# Altium project AudioDSP-v2.0.PrjPcb
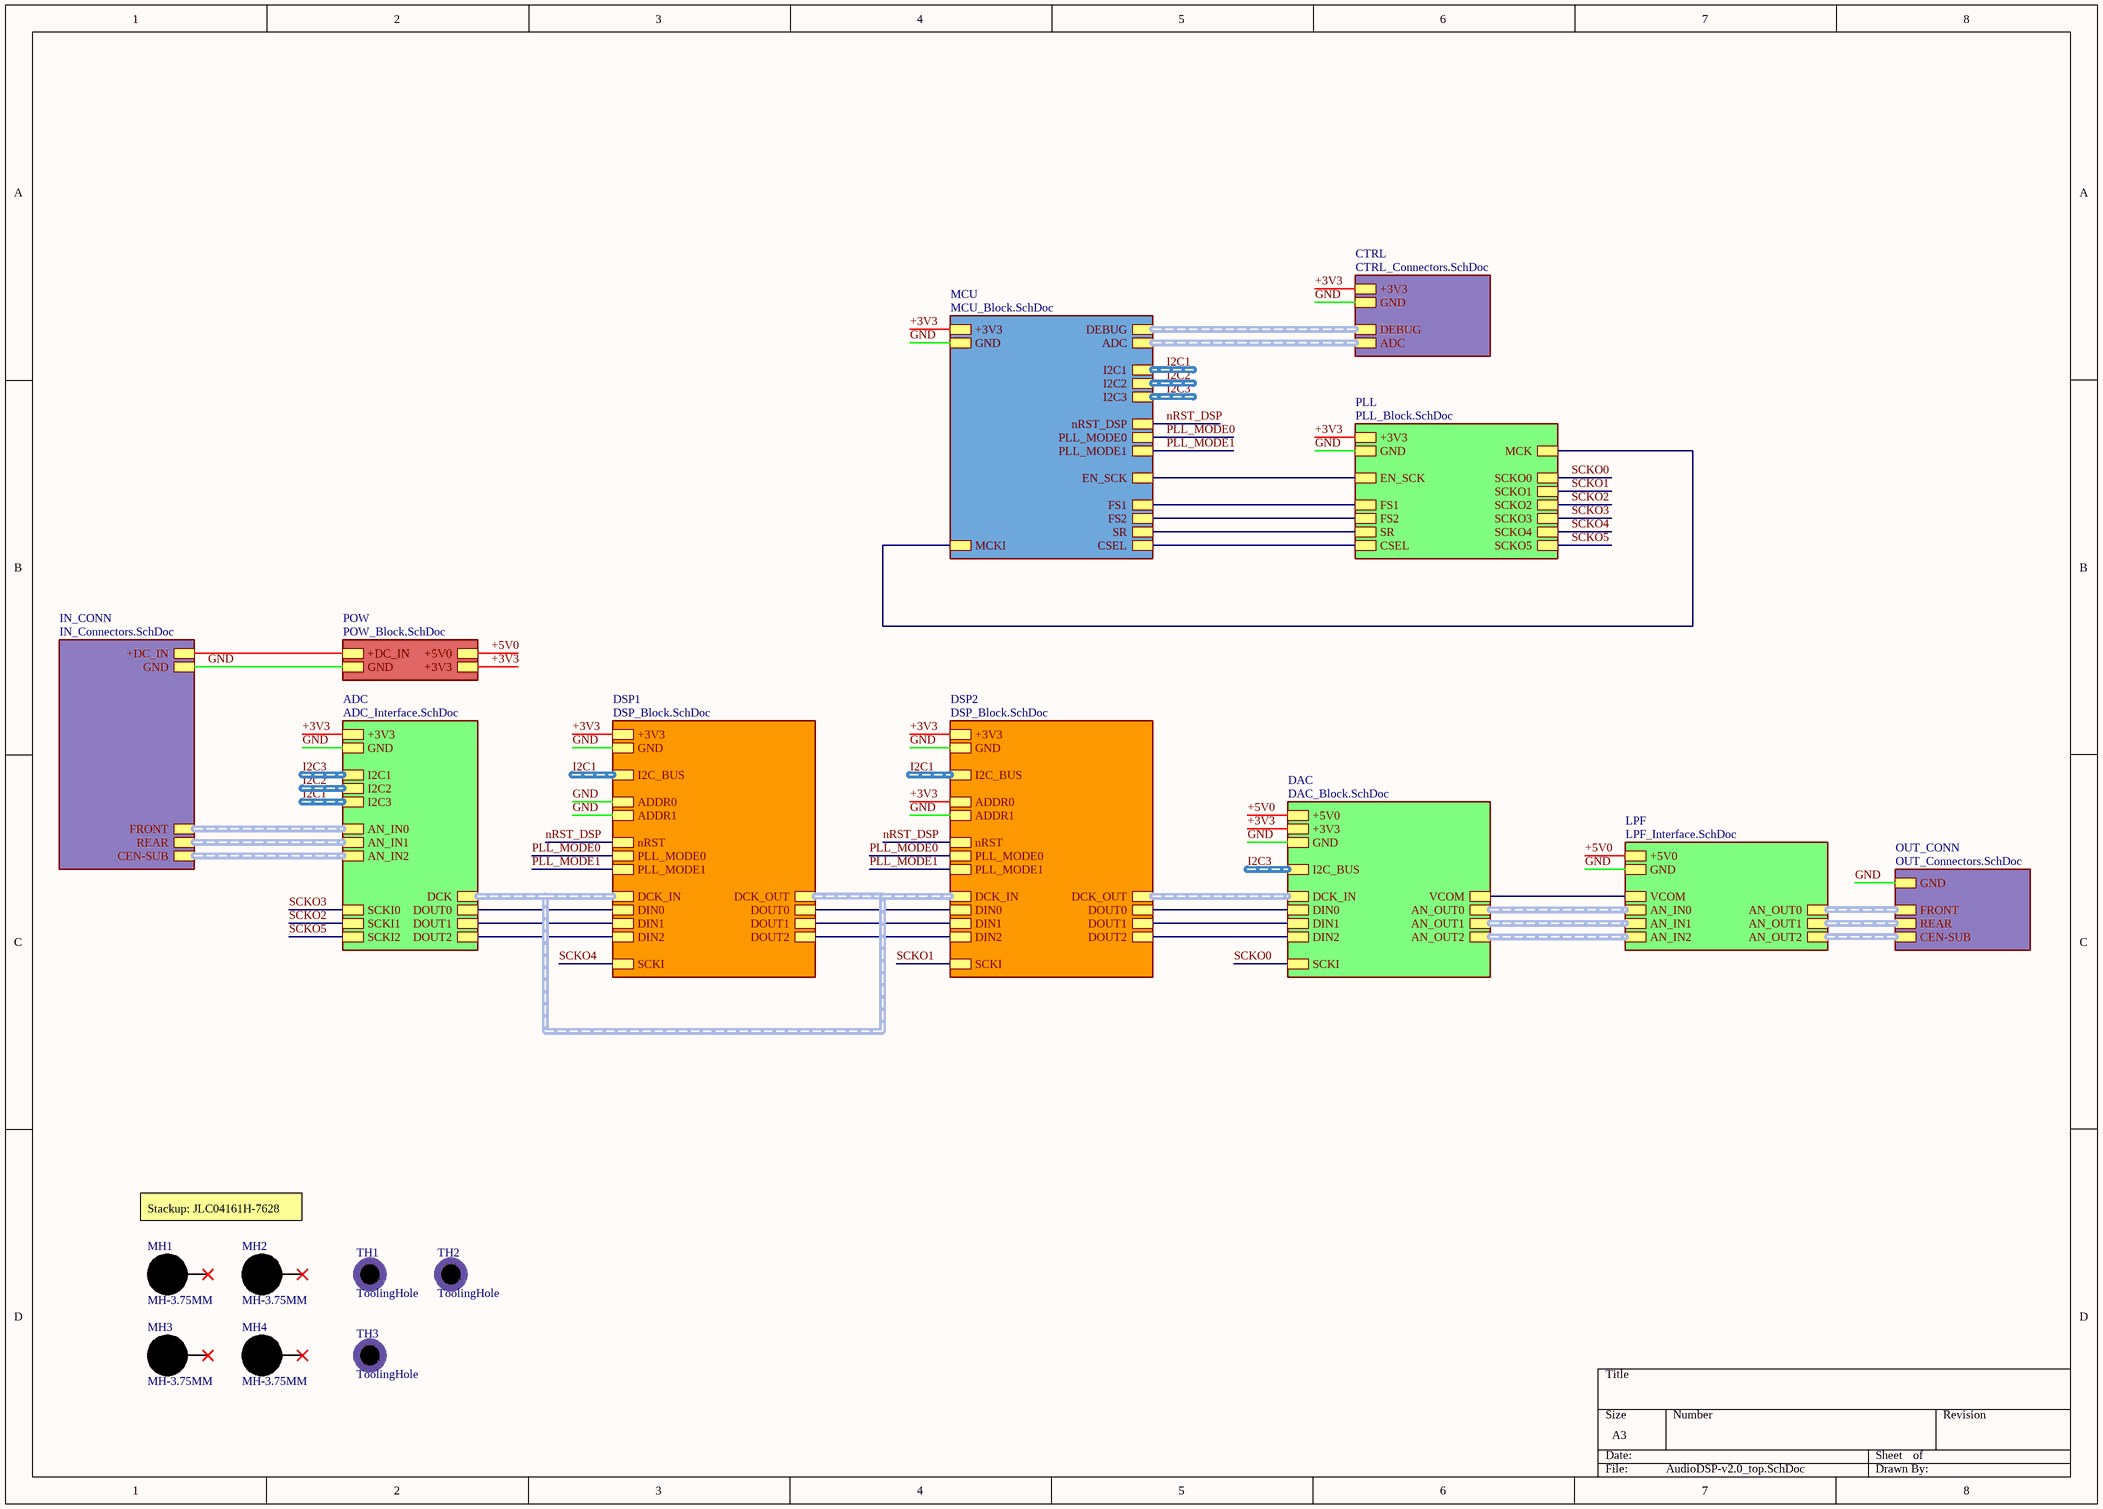
[diagram p0: AudioDSP-v2.0_top.SchDoc]
9 sheets, 164 parts. Net scope: hierarchical (ports join the sheet entries above them; power ports are global).
Board file: AudioDSP-2.0.PcbDoc
Sheets:
  AudioDSP-v2.0_top.SchDoc
    PLL = PLL_Block.SchDoc
    DSP1 = DSP_Block.SchDoc
    DSP2 = DSP_Block.SchDoc
    DAC = DAC_Block.SchDoc
    POW = POW_Block.SchDoc
    MCU = MCU_Block.SchDoc
    CTRL = CTRL_Connectors.SchDoc
  ADC_Block.SchDoc
  LPF_Block.SchDoc

## Sheet AudioDSP-v2.0_top.SchDoc
size A3; SheetNumber: 1; SheetTotal: 13

### Parts
MH1  MH-3.75MM  [MH-3.75mm-NP]  (no BOM)
MH2  MH-3.75MM  [MH-3.75mm-NP]  (no BOM)
MH3  MH-3.75MM  [MH-3.75mm-NP]  (no BOM)
MH4  MH-3.75MM  [MH-3.75mm-NP]  (no BOM)
TH1  ToolingHole  [TOOLING-HOLE]  (no BOM)
TH2  ToolingHole  [TOOLING-HOLE]  (no BOM)
TH3  ToolingHole  [TOOLING-HOLE]  (no BOM)

### Sub-sheets
ADC = ADC_Interface.SchDoc (file not in this document): +3V3, GND, I2C1 (harness I2C), AN_IN1 (harness AN), SCKI0, I2C2 (harness I2C), I2C3 (harness I2C), SCKI2, SCKI1, AN_IN2 (harness AN), AN_IN0 (harness AN), DCK (harness DCK), DOUT0, DOUT1, DOUT2
CTRL = CTRL_Connectors.SchDoc: DEBUG (harness SW), +3V3, GND, ADC (harness ADC)
DAC = DAC_Block.SchDoc: +3V3, GND, I2C_BUS (harness I2C), +5V0, VCOM, DIN0, DIN1, DIN2, DCK_IN (harness DCK), SCKI, AN_OUT0 (harness AN), AN_OUT1 (harness AN), AN_OUT2 (harness AN)
DSP1 = DSP_Block.SchDoc: +3V3, GND, PLL_MODE0, PLL_MODE1, SCKI, nRST, ADDR0, ADDR1, I2C_BUS (harness I2C), DCK_IN (harness DCK), DIN0, DIN1, DIN2, DCK_OUT (harness DCK), DOUT0, DOUT1, DOUT2
DSP2 = DSP_Block.SchDoc: +3V3, GND, PLL_MODE0, PLL_MODE1, SCKI, nRST, ADDR0, ADDR1, I2C_BUS (harness I2C), DCK_IN (harness DCK), DIN0, DIN1, DIN2, DCK_OUT (harness DCK), DOUT0, DOUT1, DOUT2
IN_CONN = IN_Connectors.SchDoc (file not in this document): +DC_IN, GND, FRONT (harness AN), REAR (harness AN), CEN-SUB (harness AN)
LPF = LPF_Interface.SchDoc (file not in this document): +5V0, GND, VCOM, AN_IN0 (harness AN), AN_IN1 (harness AN), AN_IN2 (harness AN), AN_OUT0 (harness AN), AN_OUT1 (harness AN), AN_OUT2 (harness AN)
MCU = MCU_Block.SchDoc: +3V3, GND, DEBUG (harness SW), ADC (harness ADC), I2C1 (harness I2C), I2C2 (harness I2C), I2C3 (harness I2C), MCKI, nRST_DSP, PLL_MODE0, PLL_MODE1, EN_SCK, FS1, FS2, SR, CSEL
OUT_CONN = OUT_Connectors.SchDoc (file not in this document): FRONT (harness AN), REAR (harness AN), CEN-SUB (harness AN), GND
PLL = PLL_Block.SchDoc: +3V3, GND, FS1, FS2, SR, CSEL, MCK, EN_SCK, SCKO0, SCKO1, SCKO2, SCKO3, SCKO4, SCKO5
POW = POW_Block.SchDoc: +DC_IN, GND, +5V0, +3V3

### Nets
+3V3: sheet PLL/+3V3, sheet DSP1/+3V3, sheet DSP2/+3V3, sheet DSP2/ADDR0, sheet DAC/+3V3, sheet POW/+3V3, sheet MCU/+3V3, sheet CTRL/+3V3, sheet ADC/+3V3
+5V0: sheet DAC/+5V0, sheet POW/+5V0, sheet LPF/+5V0
+DC_IN: sheet POW/+DC_IN, sheet IN_CONN/+DC_IN
CSEL: sheet PLL/CSEL, sheet MCU/CSEL
EN_SCK: sheet PLL/EN_SCK, sheet MCU/EN_SCK
FS1: sheet PLL/FS1, sheet MCU/FS1
FS2: sheet PLL/FS2, sheet MCU/FS2
GND: sheet PLL/GND, sheet DSP1/GND, sheet DSP1/ADDR0, sheet DSP1/ADDR1, sheet DSP2/GND, sheet DSP2/ADDR1, sheet DAC/GND, sheet POW/GND, sheet IN_CONN/GND, sheet OUT_CONN/GND, sheet MCU/GND, sheet CTRL/GND, sheet ADC/GND, sheet LPF/GND
MCK: sheet PLL/MCK, sheet MCU/MCKI
nRST_DSP: sheet DSP1/nRST, sheet DSP2/nRST, sheet MCU/nRST_DSP
PLL_MODE0: sheet DSP1/PLL_MODE0, sheet DSP2/PLL_MODE0, sheet MCU/PLL_MODE0
PLL_MODE1: sheet DSP1/PLL_MODE1, sheet DSP2/PLL_MODE1, sheet MCU/PLL_MODE1
SCKO0: sheet PLL/SCKO0, sheet DAC/SCKI
SCKO1: sheet PLL/SCKO1, sheet DSP2/SCKI
SCKO2: sheet PLL/SCKO2, sheet ADC/SCKI1
SCKO3: sheet PLL/SCKO3, sheet ADC/SCKI0
SCKO4: sheet PLL/SCKO4, sheet DSP1/SCKI
SCKO5: sheet PLL/SCKO5, sheet ADC/SCKI2
SR: sheet PLL/SR, sheet MCU/SR
NetU1#2_6: sheet DSP2/DOUT0, sheet DAC/DIN0
NetU1#2_11: sheet DSP2/DOUT1, sheet DAC/DIN1
NetU1#2_12: sheet DSP2/DOUT2, sheet DAC/DIN2
NetU1_DSP1_10: sheet DSP1/DIN1, sheet ADC/DOUT1
NetU1_DSP1_11: sheet DSP1/DIN0, sheet ADC/DOUT0
NetU1_DSP1_14: sheet DSP1/DOUT1, sheet DSP2/DIN1
NetU1_DSP1_15: sheet DSP1/DOUT0, sheet DSP2/DIN0
NetU1_DSP1_27: sheet DSP1/DOUT2, sheet DSP2/DIN2
NetU1_DSP1_29: sheet DSP1/DIN2, sheet ADC/DOUT2
NetU2#2_1: sheet DAC/VCOM, sheet LPF/VCOM

Not connected (* = marked no-connect by the designer): MH1 1*; MH2 1*; MH3 1*; MH4 1*

### Buses and harness runs
harness I2C1 = sheet ADC/I2C3
harness I2C1 = sheet DSP1/I2C_BUS
harness I2C1 = sheet DSP2/I2C_BUS
harness I2C1 = sheet MCU/I2C1
harness I2C2 = sheet ADC/I2C2
harness I2C2 = sheet MCU/I2C2
harness I2C3 = sheet ADC/I2C1
harness I2C3 = sheet DAC/I2C_BUS
harness I2C3 = sheet MCU/I2C3
harness sheet ADC/AN_IN0 = sheet IN_CONN/FRONT
harness sheet ADC/AN_IN1 = sheet IN_CONN/REAR
harness sheet ADC/AN_IN2 = sheet IN_CONN/CEN-SUB
harness sheet ADC/DCK = sheet DSP1/DCK_IN = sheet DSP1/DCK_OUT = sheet DSP2/DCK_IN
harness sheet CTRL/ADC = sheet MCU/ADC
harness sheet CTRL/DEBUG = sheet MCU/DEBUG
harness sheet DAC/AN_OUT0 = sheet LPF/AN_IN0
harness sheet DAC/AN_OUT1 = sheet LPF/AN_IN1
harness sheet DAC/AN_OUT2 = sheet LPF/AN_IN2
harness sheet DAC/DCK_IN = sheet DSP2/DCK_OUT
harness sheet LPF/AN_OUT0 = sheet OUT_CONN/FRONT
harness sheet LPF/AN_OUT1 = sheet OUT_CONN/REAR
harness sheet LPF/AN_OUT2 = sheet OUT_CONN/CEN-SUB

### Notes on the sheet
- Stackup: JLC04161H-7628

### Library data of the parts
MH1-MH4 = MH-3.75MM: ClassName: MountHole
TH1-TH3 = ToolingHole: ClassName: Tooling

## Sheet PLL_Block.SchDoc
size A4; SheetNumber: 2; SheetTotal: 13
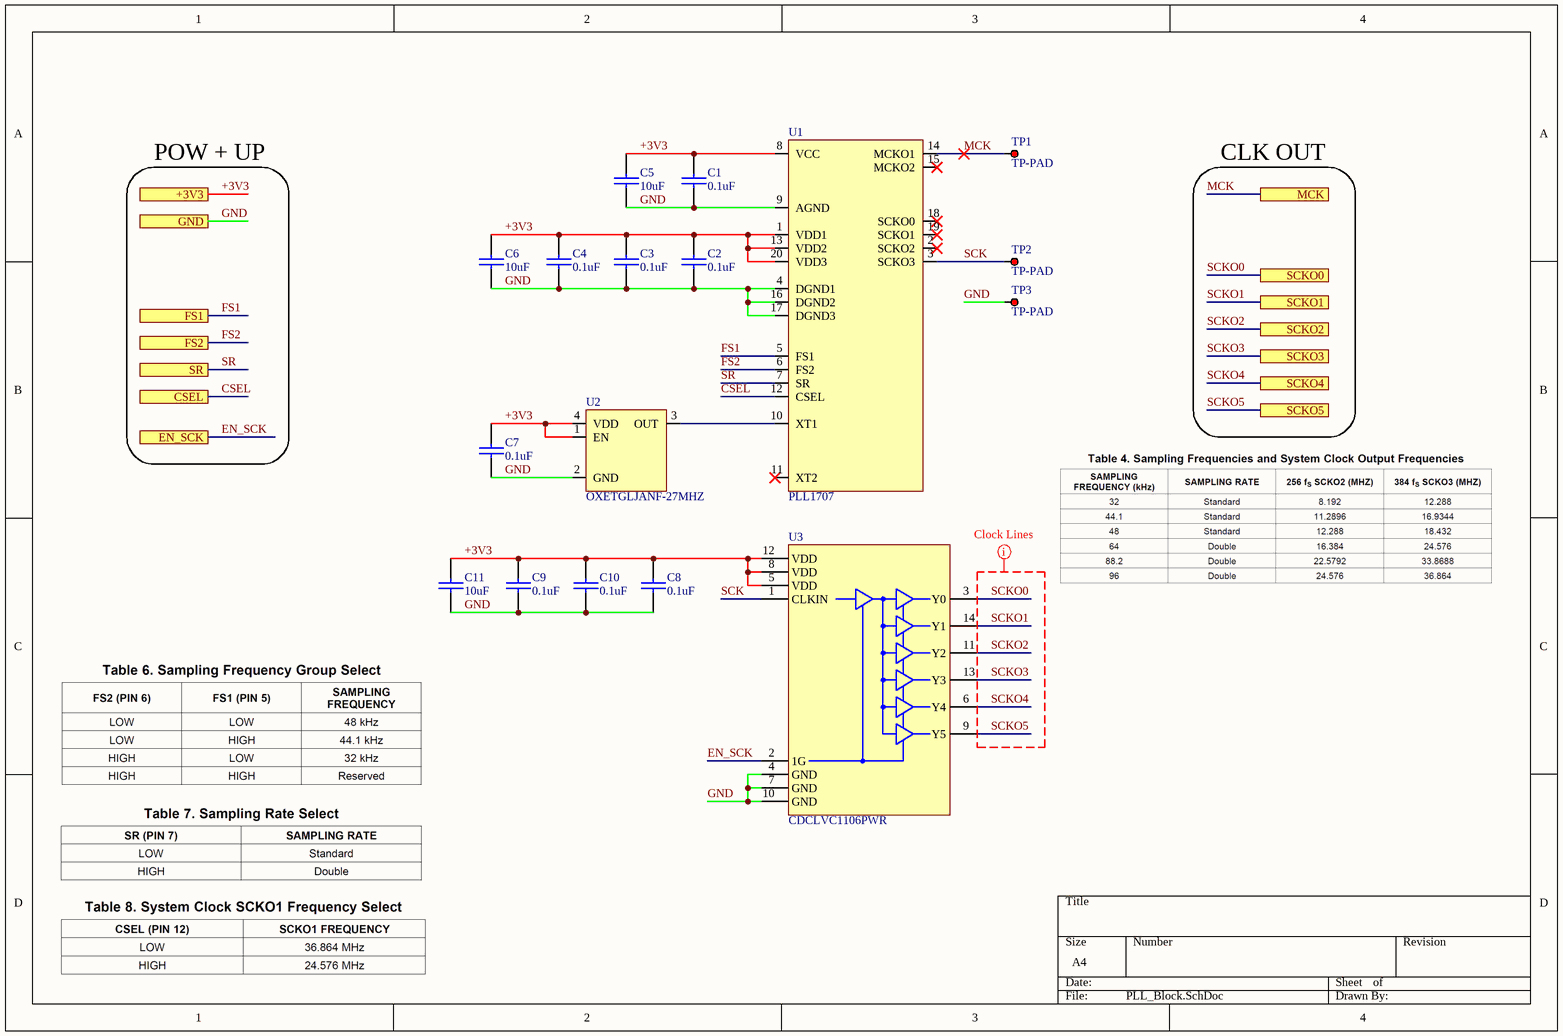
[diagram p1: PLL_Block.SchDoc]

### Parts
(Parts that share a designator on the sheet are numbered #1, #2 ... from top to bottom, then left to right.)
C1#1  0.1uF  [0402-CAP-TDK]
C2#1  0.1uF  [0402-CAP-TDK]
C3#1  0.1uF  [0402-CAP-TDK]
C4#1  0.1uF  [0402-CAP-TDK]
C5#1  10uF  [0603-CAP-TDK]
C6#1  10uF  [0603-CAP-TDK]
C7#1  0.1uF  [0402-CAP-TDK]
C8#1  0.1uF  [0402-CAP-TDK]
C9#1  0.1uF  [0402-CAP-TDK]
C10#1  0.1uF  [0402-CAP-TDK]
C11  10uF  [0603-CAP-TDK]
TP1#1  TP-PAD  [TPTH - PAD TOP]  (no BOM)
TP2#1  TP-PAD  [TPTH - PAD TOP]  (no BOM)
TP3#1  TP-PAD  [TPTH - PAD TOP]  (no BOM)
U1#1  PLL1707  [TI-SSOP-20 - DBQ (R-PDSO-G20)]
U2#1  OXETGLJANF-27MHZ  [SMD3225]
U3  CDCLVC1106PWR  [TI-TSSOP-14-PW0014A]

### Ports
+3V3 (see AudioDSP-v2.0_top[6B], ADC_Block[1A], ADC_Interface[1B], CTRL_Connectors[1A], DAC_Block[1B], DSP_Block[1A], MCU_Block[1A], POW_Block[4B]), CSEL (see AudioDSP-v2.0_top[6B], MCU_Block[4C]), EN_SCK (see AudioDSP-v2.0_top[6B], MCU_Block[4C]), FS1 (see AudioDSP-v2.0_top[6B], MCU_Block[4C]), FS2 (see AudioDSP-v2.0_top[6B], MCU_Block[4C]), GND (see AudioDSP-v2.0_top[6B], ADC_Block[1B], ADC_Interface[1B], CTRL_Connectors[1A], DAC_Block[1B], DSP_Block[1B], IN_Connectors[3A], LPF_Block[1B], LPF_Interface[1B], MCU_Block[1B], OUT_Connectors[3B], POW_Block[1B]), MCK (see AudioDSP-v2.0_top[6B]), SCKO0 (see AudioDSP-v2.0_top[6B]), SCKO1 (see AudioDSP-v2.0_top[6B]), SCKO2 (see AudioDSP-v2.0_top[6B]), SCKO3 (see AudioDSP-v2.0_top[6B]), SCKO4 (see AudioDSP-v2.0_top[6B]), SCKO5 (see AudioDSP-v2.0_top[6B]), SR (see AudioDSP-v2.0_top[6B], MCU_Block[4C])

### Nets
+3V3: C1#1.2 C2#1.2 C3#1.2 C4#1.2 C5#1.2 C6#1.2 C7#1.2 C8#1.2 C9#1.2 C10#1.2 C11.2 U1#1.1(VDD1) U1#1.8(VCC) U1#1.13(VDD2) U1#1.20(VDD3) U2#1.1(EN) U2#1.4(VDD) U3.5(VDD) U3.8(VDD) U3.12(VDD) ; port +3V3
CSEL: U1#1.12(CSEL) ; port CSEL
EN_SCK: U3.2(1G) ; port EN_SCK
FS1: U1#1.5(FS1) ; port FS1
FS2: U1#1.6(FS2) ; port FS2
GND: C1#1.1 C2#1.1 C3#1.1 C4#1.1 C5#1.1 C6#1.1 C7#1.1 C8#1.1 C9#1.1 C10#1.1 C11.1 TP3#1.1 U1#1.4(DGND1) U1#1.9(AGND) U1#1.16(DGND2) U1#1.17(DGND3) U2#1.2(GND) U3.4(GND) U3.7(GND) U3.10(GND) ; port GND
MCK: TP1#1.1 U1#1.14(MCKO1) ; port MCK
SCK: TP2#1.1 U1#1.3(SCKO3) U3.1(CLKIN)
SCKO0: U3.3(Y0) ; port SCKO0
SCKO1: U3.14(Y1) ; port SCKO1
SCKO2: U3.11(Y2) ; port SCKO2
SCKO3: U3.13(Y3) ; port SCKO3
SCKO4: U3.6(Y4) ; port SCKO4
SCKO5: U3.9(Y5) ; port SCKO5
SR: U1#1.7(SR) ; port SR
NetU1#1_10: U1#1.10(XT1) U2#1.3(OUT)

Not connected (* = marked no-connect by the designer): U1#1 2(SCKO2)* 11(XT2)* 15(MCKO2)* 18(SCKO0)* 19(SCKO1)*

### Layout directives
net class CLK: SCKO0, SCKO1, SCKO2, SCKO3, SCKO4, SCKO5

### Notes on the sheet
- POW + UP
- CLK OUT

### Library data of the parts
C1#1 C2#1 C3#1 C4#1 C5#1 C6#1 C7#1 C8#1 C9#1 C10#1 C11 = CAP-SMD
  C1#1 C2#1 C3#1 C4#1 C7#1 C8#1 C9#1 C10#1: JLCPart: C307331
  C5#1 C6#1 C11: JLCPart: C96446
U1#1 = PLL1707: Dual PLL Multi-Clock Generator; JLCPart: C1519963
U2#1 = OXETGLJANF-27MHZ: 3.3V ±50ppm 27MHz SMD3225-4P Oscillators; JLCPart: C295526
U3 = CDCLVC1106PWR: LVCMOS High-Performance Clock Buffer 6-Output; JLCPart: C56506

## Sheet DSP_Block.SchDoc
size A4; SheetNumber: 4; SheetTotal: 4
Used 2 times, as channels DSP1, DSP2. Parts and nets are listed once, with the designators drawn on the sheet.
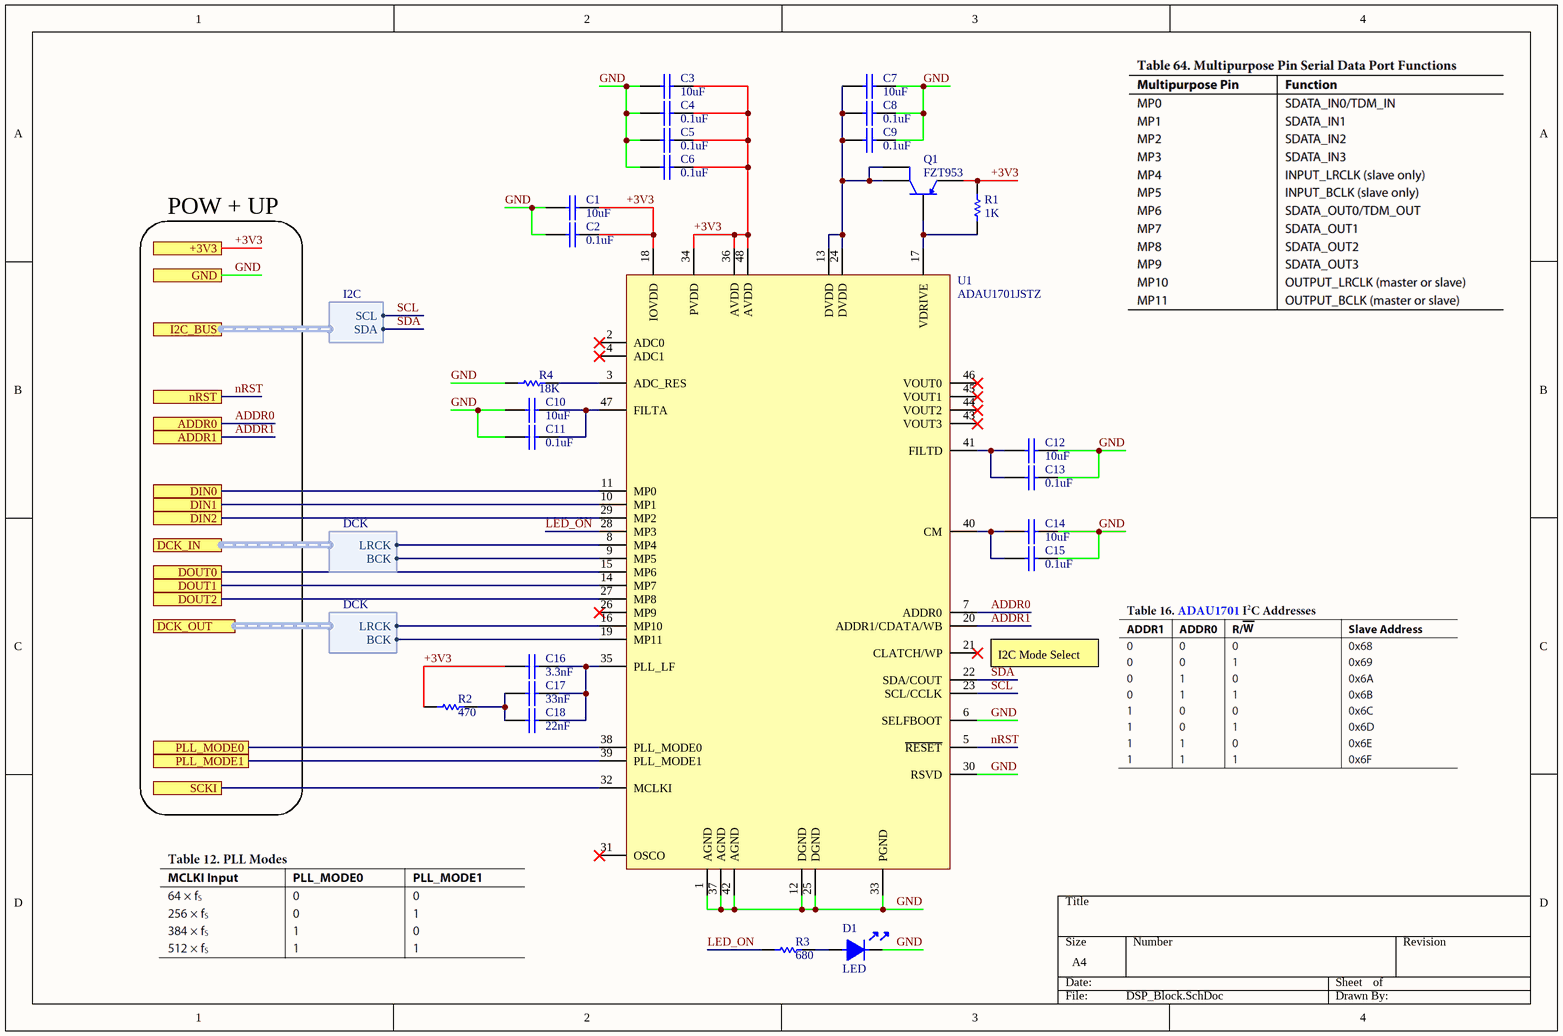
[diagram p2: DSP_Block.SchDoc]

### Parts
C1  10uF  [0603-CAP-TDK]
C2  0.1uF  [0402-CAP-TDK]
C3  10uF  [0603-CAP-TDK]
C4  0.1uF  [0402-CAP-TDK]
C5  0.1uF  [0402-CAP-TDK]
C6  0.1uF  [0402-CAP-TDK]
C7  10uF  [0603-CAP-TDK]
C8  0.1uF  [0402-CAP-TDK]
C9  0.1uF  [0402-CAP-TDK]
C10  10uF  [0603-CAP-TDK]
C11  0.1uF  [0402-CAP-TDK]
C12  10uF  [0603-CAP-TDK]
C13  0.1uF  [0402-CAP-TDK]
C14  10uF  [0603-CAP-TDK]
C15  0.1uF  [0402-CAP-TDK]
C16  3.3nF  [0402-CAP-TDK]
C17  33nF  [0603-CAP-TDK]
C18  22nF  [0603-CAP-TDK]
D1  LED  [LED-0805]
Q1  FZT953  [SOT223-DN]
R1  1K  [0402-RES-PANASONIC]
R2  470  [0402-RES-PANASONIC]
R3  680  [0402-RES-PANASONIC]
R4  18K  [0402-RES-PANASONIC]
U1  ADAU1701JSTZ  [LQFP-48 - ST-48]

### Ports
+3V3 (see AudioDSP-v2.0_top[2A]), ADDR0, ADDR1, DCK_IN (harness DCK), DCK_OUT (harness DCK), DIN0, DIN1, DIN2, DOUT0, DOUT1, DOUT2, GND (see AudioDSP-v2.0_top[2B]), I2C_BUS (harness I2C, see AudioDSP-v2.0_top[2B]), nRST, PLL_MODE0, PLL_MODE1, SCKI

### Harnesses
I2C: SCL, SDA
DCK: BCK, LRCK

### Nets
+3V3: C1.1 C2.1 C3.1 C4.1 C5.1 C6.1 C16.1 Q1.E R1.2 R2.1 U1.18(IOVDD) U1.34(PVDD) U1.36(AVDD) U1.48(AVDD) ; port +3V3
ADDR0: U1.7(ADDR0) ; port ADDR0
ADDR1: U1.20(ADDR1/CDATA/WB) ; port ADDR1
DIN0: U1.11(MP0) ; port DIN0
DIN1: U1.10(MP1) ; port DIN1
DIN2: U1.29(MP2) ; port DIN2
DOUT0: U1.15(MP6) ; port DOUT0
DOUT1: U1.14(MP7) ; port DOUT1
DOUT2: U1.27(MP8) ; port DOUT2
GND: C1.2 C2.2 C3.2 C4.2 C5.2 C6.2 C7.1 C8.1 C9.1 C10.2 C11.2 C12.1 C13.1 C14.1 C15.1 D1.2 R4.1 U1.1(AGND) U1.6(SELFBOOT) U1.12(DGND) U1.25(DGND) U1.30(RSVD) U1.33(PGND) U1.37(AGND) U1.42(AGND) ; port GND
LED_ON: R3.1 U1.28(MP3)
nRST: U1.5(~{RESET}) ; port nRST
PLL_MODE0: U1.38(PLL_MODE0) ; port PLL_MODE0
PLL_MODE1: U1.39(PLL_MODE1) ; port PLL_MODE1
SCKI: U1.32(MCLKI) ; port SCKI
SCL: U1.23(SCL/CCLK) ; port I2C_BUS.SCL
SDA: U1.22(SDA/COUT) ; port I2C_BUS.SDA
NetC7_2: C7.2 C8.2 C9.2 Q1.C Q1.C-TAB U1.13(DVDD) U1.24(DVDD)
NetC10_1: C10.1 C11.1 U1.47(FILTA)
NetC12_2: C12.2 C13.2 U1.41(FILTD)
NetC14_2: C14.2 C15.2 U1.40(CM)
NetC16_2: C16.2 C17.2 C18.2 U1.35(PLL_LF)
NetC17_1: C17.1 C18.1 R2.2
NetD1_1: D1.1 R3.2
NetQ1_B: Q1.B R1.1 U1.17(VDRIVE)
NetR4_2: R4.2 U1.3(ADC_RES)
NetU1_8: U1.8(MP4) ; port DCK_IN.LRCK
NetU1_9: U1.9(MP5) ; port DCK_IN.BCK
NetU1_16: U1.16(MP10) ; port DCK_OUT.LRCK
NetU1_19: U1.19(MP11) ; port DCK_OUT.BCK

Not connected (* = marked no-connect by the designer): U1 2(ADC0)* 4(ADC1)* 21(CLATCH/WP)* 26(MP9)* 31(OSCO)* 43(VOUT3)* 44(VOUT2)* 45(VOUT1)* 46(VOUT0)*

### Channels
DSP1: designators end in _DSP1; ports +3V3=+3V3 ADDR0=GND ADDR1=GND DIN0=NetU1_DSP1_11 DIN1=NetU1_DSP1_10 DIN2=NetU1_DSP1_29 DOUT0=NetU1_DSP1_15 DOUT1=NetU1_DSP1_14 DOUT2=NetU1_DSP1_27 GND=GND nRST=nRST_DSP PLL_MODE0=PLL_MODE0 PLL_MODE1=PLL_MODE1 SCKI=SCKO4
DSP2: designators end in _DSP2; ports +3V3=+3V3 ADDR0=+3V3 ADDR1=GND DIN0=NetU1_DSP1_15 DIN1=NetU1_DSP1_14 DIN2=NetU1_DSP1_27 DOUT0=NetU1#2_6 DOUT1=NetU1#2_11 DOUT2=NetU1#2_12 GND=GND nRST=nRST_DSP PLL_MODE0=PLL_MODE0 PLL_MODE1=PLL_MODE1 SCKI=SCKO1

### Notes on the sheet
- POW + UP
- (near U1) I2C Mode Select

### Library data of the parts
C1-C18 = CAP-SMD
D1 = LED-SMD
R1-R4 = RES-SMD
U1 = ADAU1701JSTZ: SigmaDSP 28-/56-Bit Audio Processor with Two ADCs and Four DACs

## Sheet DAC_Block.SchDoc
size A4; SheetNumber: 4; SheetTotal: 13
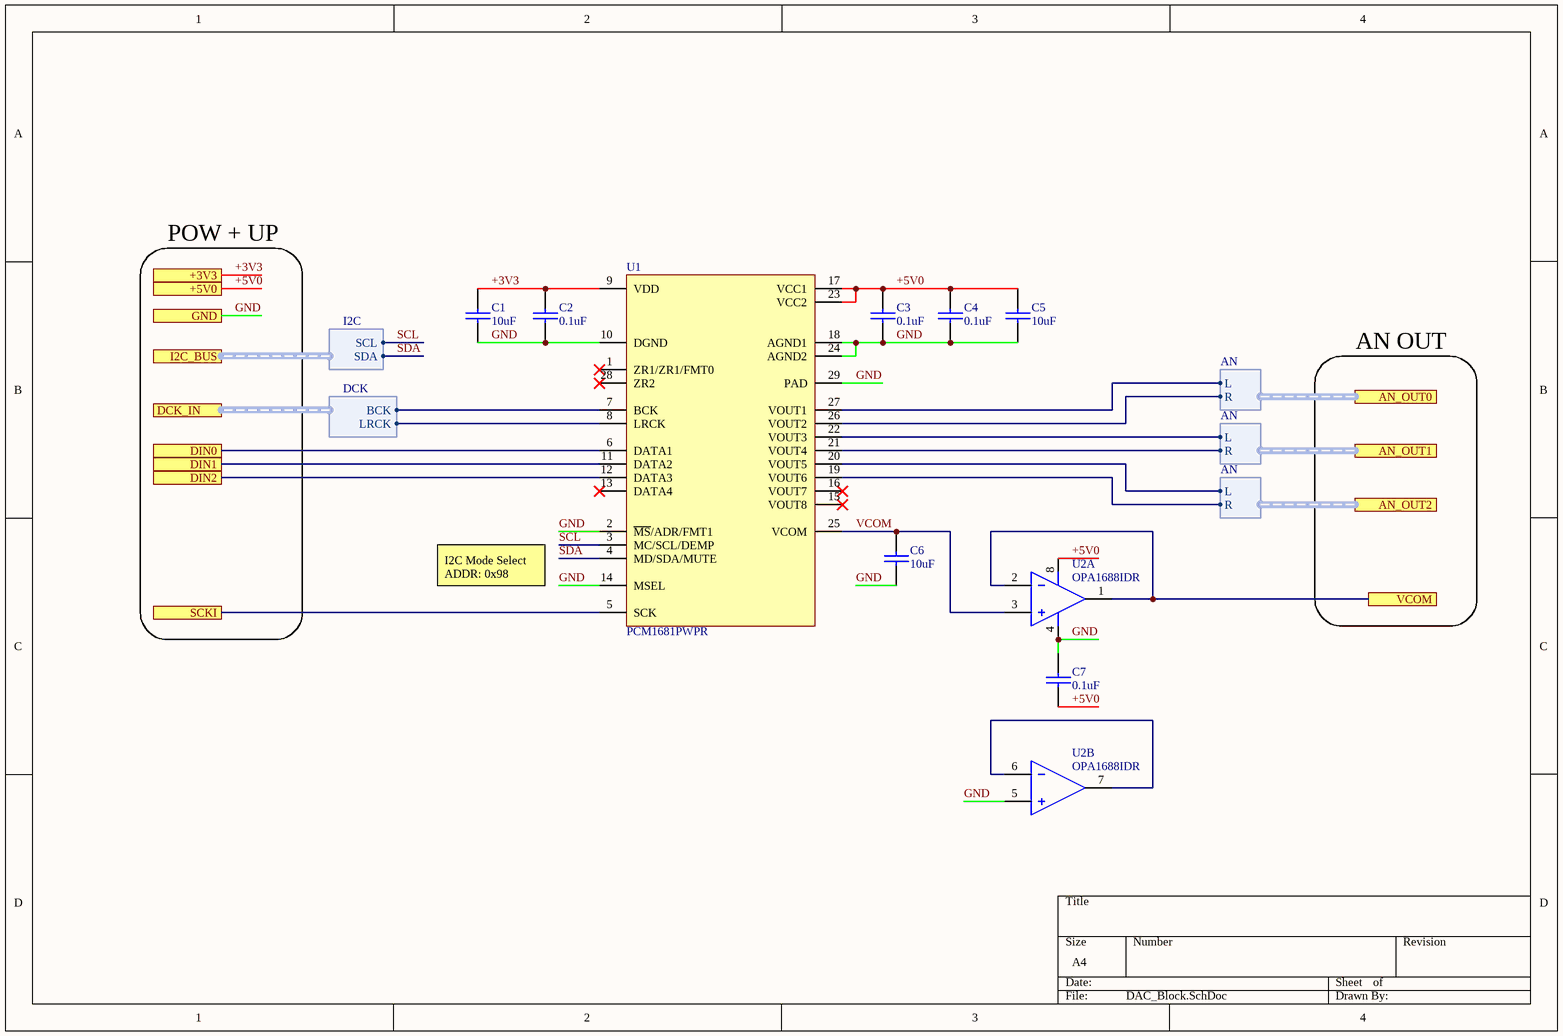
[diagram p3: DAC_Block.SchDoc]

### Parts
(Parts that share a designator on the sheet are numbered #1, #2 ... from top to bottom, then left to right.)
C1#2  10uF  [0603-CAP-TDK]
C2#2  0.1uF  [0402-CAP-TDK]
C3#2  0.1uF  [0402-CAP-TDK]
C4#2  0.1uF  [0402-CAP-TDK]
C5#2  10uF  [0603-CAP-TDK]
C6#2  10uF  [0603-CAP-TDK]
C7#2  0.1uF  [0402-CAP-TDK]
U1#2  PCM1681PWPR  [PCM1681PWPR]
U2#2  OPA1688IDR  [TI-SOIC-8]  (parts A,B of 2)

### Ports
+3V3 (see AudioDSP-v2.0_top[5C], ADC_Block[1A], ADC_Interface[1B], CTRL_Connectors[1A], DSP_Block[1A], MCU_Block[1A], PLL_Block[1A], POW_Block[4B]), +5V0 (see AudioDSP-v2.0_top[5C], LPF_Block[1B], LPF_Interface[1B], POW_Block[4B]), AN_OUT0 (harness AN, see AudioDSP-v2.0_top[6C]), AN_OUT1 (harness AN, see AudioDSP-v2.0_top[6C]), AN_OUT2 (harness AN, see AudioDSP-v2.0_top[6C]), DCK_IN (harness DCK, see AudioDSP-v2.0_top[5C]), DIN0 (see AudioDSP-v2.0_top[5C]), DIN1 (see AudioDSP-v2.0_top[5C]), DIN2 (see AudioDSP-v2.0_top[5C]), GND (see AudioDSP-v2.0_top[5C], ADC_Block[1B], ADC_Interface[1B], CTRL_Connectors[1A], DSP_Block[1B], IN_Connectors[3A], LPF_Block[1B], LPF_Interface[1B], MCU_Block[1B], OUT_Connectors[3B], PLL_Block[1A], POW_Block[1B]), I2C_BUS (harness I2C, see AudioDSP-v2.0_top[5C], ADC_Block[1B]), SCKI (see AudioDSP-v2.0_top[5C]), VCOM (see AudioDSP-v2.0_top[6C], LPF_Block[1C], LPF_Interface[1B])

### Harnesses
I2C: SCL, SDA
DCK: BCK, LRCK
AN: L, R

### Nets
+3V3: C1#2.2 C2#2.2 U1#2.9(VDD) ; port +3V3
+5V0: C3#2.2 C4#2.2 C5#2.2 C7#2.1 U1#2.17(VCC1) U1#2.23(VCC2) U2#2.8(VDD) ; port +5V0
GND: C1#2.1 C2#2.1 C3#2.1 C4#2.1 C5#2.1 C6#2.1 C7#2.2 U1#2.2(~{MS}/ADR/FMT1) U1#2.10(DGND) U1#2.14(MSEL) U1#2.18(AGND1) U1#2.24(AGND2) U1#2.29(PAD) U2#2.4(GND) U2#2.5(2IN+) ; port GND
SCKO0: U1#2.5(SCK) ; port SCKI
SCL: U1#2.3(MC/SCL/DEMP) ; port I2C_BUS.SCL  [project net I2C3.SCL]
SDA: U1#2.4(MD/SDA/MUTE) ; port I2C_BUS.SDA  [project net I2C3.SDA]
VCOM: C6#2.2 U1#2.25(VCOM) U2#2.3(1IN+)
NetU1#2_6: U1#2.6(DATA1) ; port DIN0
NetU1#2_7: U1#2.7(BCK) ; port DCK_IN.BCK
NetU1#2_8: U1#2.8(LRCK) ; port DCK_IN.LRCK
NetU1#2_11: U1#2.11(DATA2) ; port DIN1
NetU1#2_12: U1#2.12(DATA3) ; port DIN2
NetU1#2_19: U1#2.19(VOUT6) ; port AN_OUT2.R
NetU1#2_20: U1#2.20(VOUT5) ; port AN_OUT2.L
NetU1#2_21: U1#2.21(VOUT4) ; port AN_OUT1.R
NetU1#2_22: U1#2.22(VOUT3) ; port AN_OUT1.L
NetU1#2_26: U1#2.26(VOUT2) ; port AN_OUT0.R
NetU1#2_27: U1#2.27(VOUT1) ; port AN_OUT0.L
NetU2#2_1: U2#2.1(1OUT) U2#2.2(1IN-) ; port VCOM
NetU2#2_6: U2#2.6(2IN-) U2#2.7(2OUT)

Not connected (* = marked no-connect by the designer): U1#2 1(ZR1/ZR1/FMT0)* 13(DATA4)* 15(VOUT8)* 16(VOUT7)* 28(ZR2)*

### Notes on the sheet
- POW + UP
- AN OUT
- I2C Mode Select
  ADDR: 0x98

### Library data of the parts
C1#2 C2#2 C3#2 C4#2 C5#2 C6#2 C7#2 = CAP-SMD
U2#2 = OPA1688IDR: Rail-To-Rail Amplifier 2 Circuit - 8-SOIC

## Sheet POW_Block.SchDoc
size A4; SheetNumber: 5; SheetTotal: 13
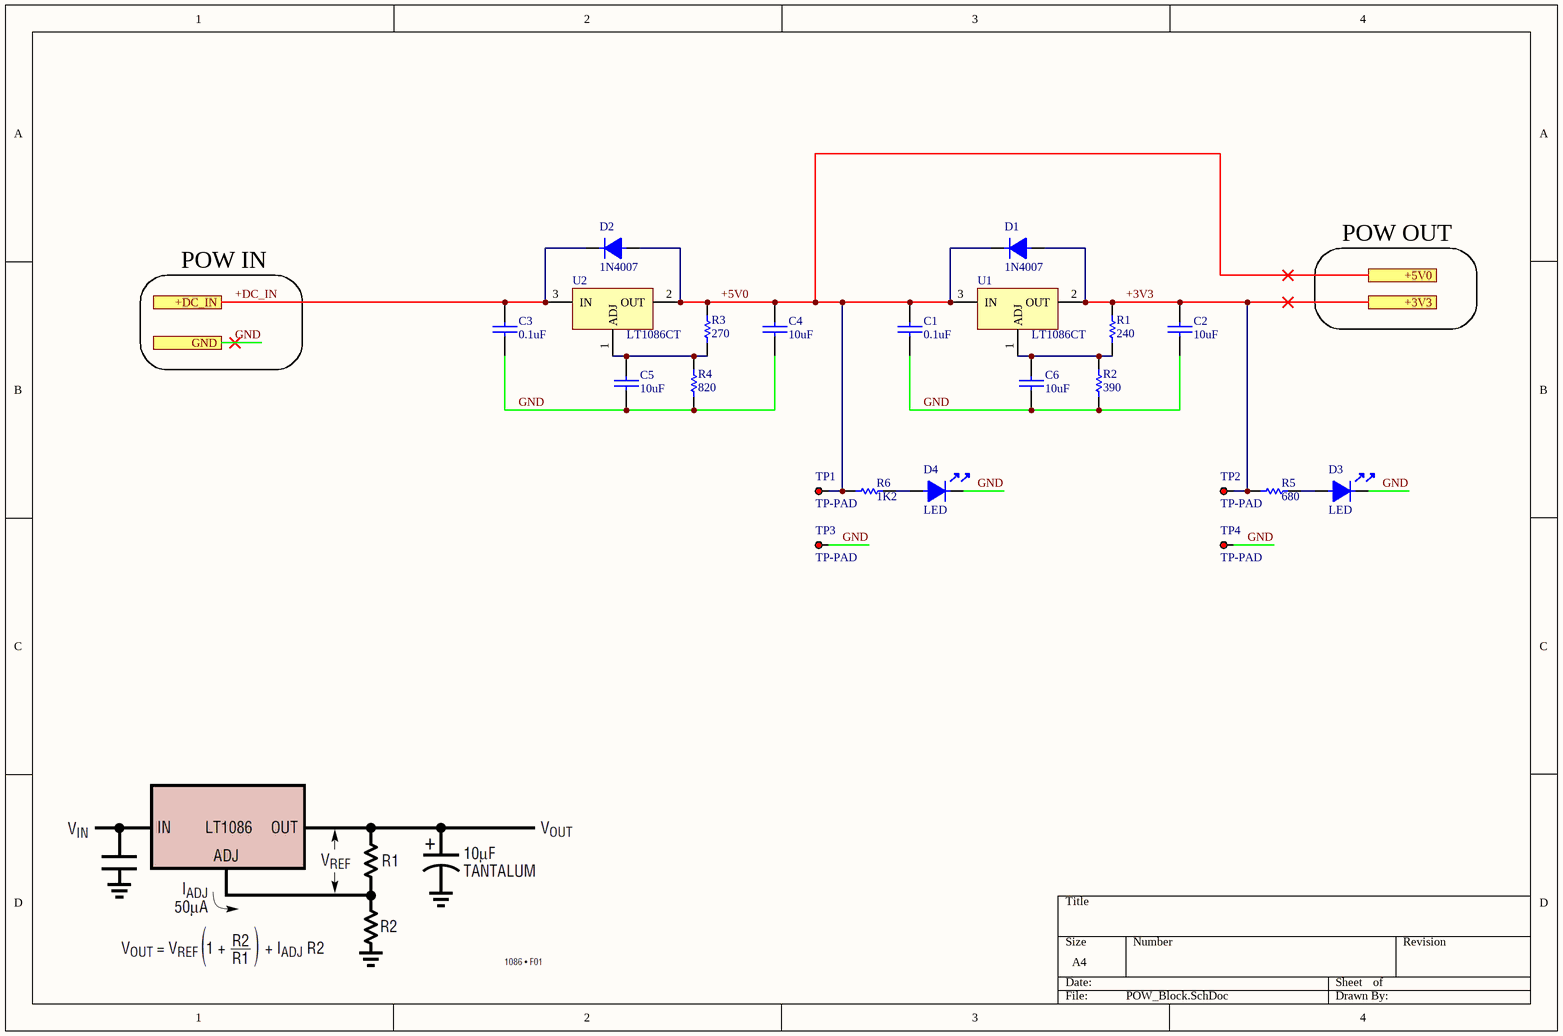
[diagram p4: POW_Block.SchDoc]

### Parts
(Parts that share a designator on the sheet are numbered #1, #2 ... from top to bottom, then left to right.)
C1#3  0.1uF  [0402-CAP-TDK]
C2#3  10uF  [0603-CAP-TDK]
C3#3  0.1uF  [0402-CAP-TDK]
C4#3  10uF  [0603-CAP-TDK]
C5#3  10uF  [0603-CAP-TDK]
C6#3  10uF  [0603-CAP-TDK]
D1  1N4007  [DO-214AC-SMA]
D2  1N4007  [DO-214AC-SMA]
D3  LED  [LED-0805]
D4  LED  [LED-0805]
R1#1  240  [0805-RES-PANASONIC]
R2#1  390  [0805-RES-PANASONIC]
R3#1  270  [0805-RES-PANASONIC]
R4#1  820  [0805-RES-PANASONIC]
R5#1  680  [0402-RES-PANASONIC]
R6#1  1K2  [0402-RES-PANASONIC]
TP1#2  TP-PAD  [TPTH - PAD TOP]  (no BOM)
TP2#2  TP-PAD  [TPTH - PAD TOP]  (no BOM)
TP3#2  TP-PAD  [TPTH - PAD TOP]  (no BOM)
TP4  TP-PAD  [TPTH - PAD TOP]  (no BOM)
U1#3  LT1086CT  [TO-220 - KCS0003B]
U2#3  LT1086CT  [TO-220 - KCS0003B]

### Ports
+3V3 (see AudioDSP-v2.0_top[2B], ADC_Block[1A], ADC_Interface[1B], CTRL_Connectors[1A], DAC_Block[1B], DSP_Block[1A], MCU_Block[1A], PLL_Block[1A]), +5V0 (see AudioDSP-v2.0_top[2B], DAC_Block[1B], LPF_Block[1B], LPF_Interface[1B]), +DC_IN (see AudioDSP-v2.0_top[2B], IN_Connectors[3A]), GND (see AudioDSP-v2.0_top[2B], ADC_Block[1B], ADC_Interface[1B], CTRL_Connectors[1A], DAC_Block[1B], DSP_Block[1B], IN_Connectors[3A], LPF_Block[1B], LPF_Interface[1B], MCU_Block[1B], OUT_Connectors[3B], PLL_Block[1A])

### Nets
+3V3: C2#3.2 D1.1 R1#1.2 R5#1.1 TP2#2.1 U1#3.2(OUT) ; port +3V3
+5V0: C1#3.2 C4#3.2 D1.2 D2.1 R3#1.2 R6#1.1 TP1#2.1 U1#3.3(IN) U2#3.2(OUT) ; port +5V0
+DC_IN: C3#3.2 D2.2 U2#3.3(IN) ; port +DC_IN
GND: C1#3.1 C2#3.1 C3#3.1 C4#3.1 C5#3.1 C6#3.1 D3.2 D4.2 R2#1.1 R4#1.1 TP3#2.1 TP4.1 ; port GND
NetC5#3_2: C5#3.2 R3#1.1 R4#1.2 U2#3.1(ADJ)
NetC6#3_2: C6#3.2 R1#1.1 R2#1.2 U1#3.1(ADJ)
NetD3_1: D3.1 R5#1.2
NetD4_1: D4.1 R6#1.2

### Notes on the sheet
- POW OUT
- POW IN

### Library data of the parts
C1#3 C2#3 C3#3 C4#3 C5#3 C6#3 = CAP-SMD
D1 D2 = 1N4007: Diode Rectifier 1A 1kV
D3 D4 = LED-SMD
R1#1 R2#1 R3#1 R4#1 R5#1 R6#1 = RES-SMD

## Sheet MCU_Block.SchDoc
size A4; SheetNumber: 8; SheetTotal: 13
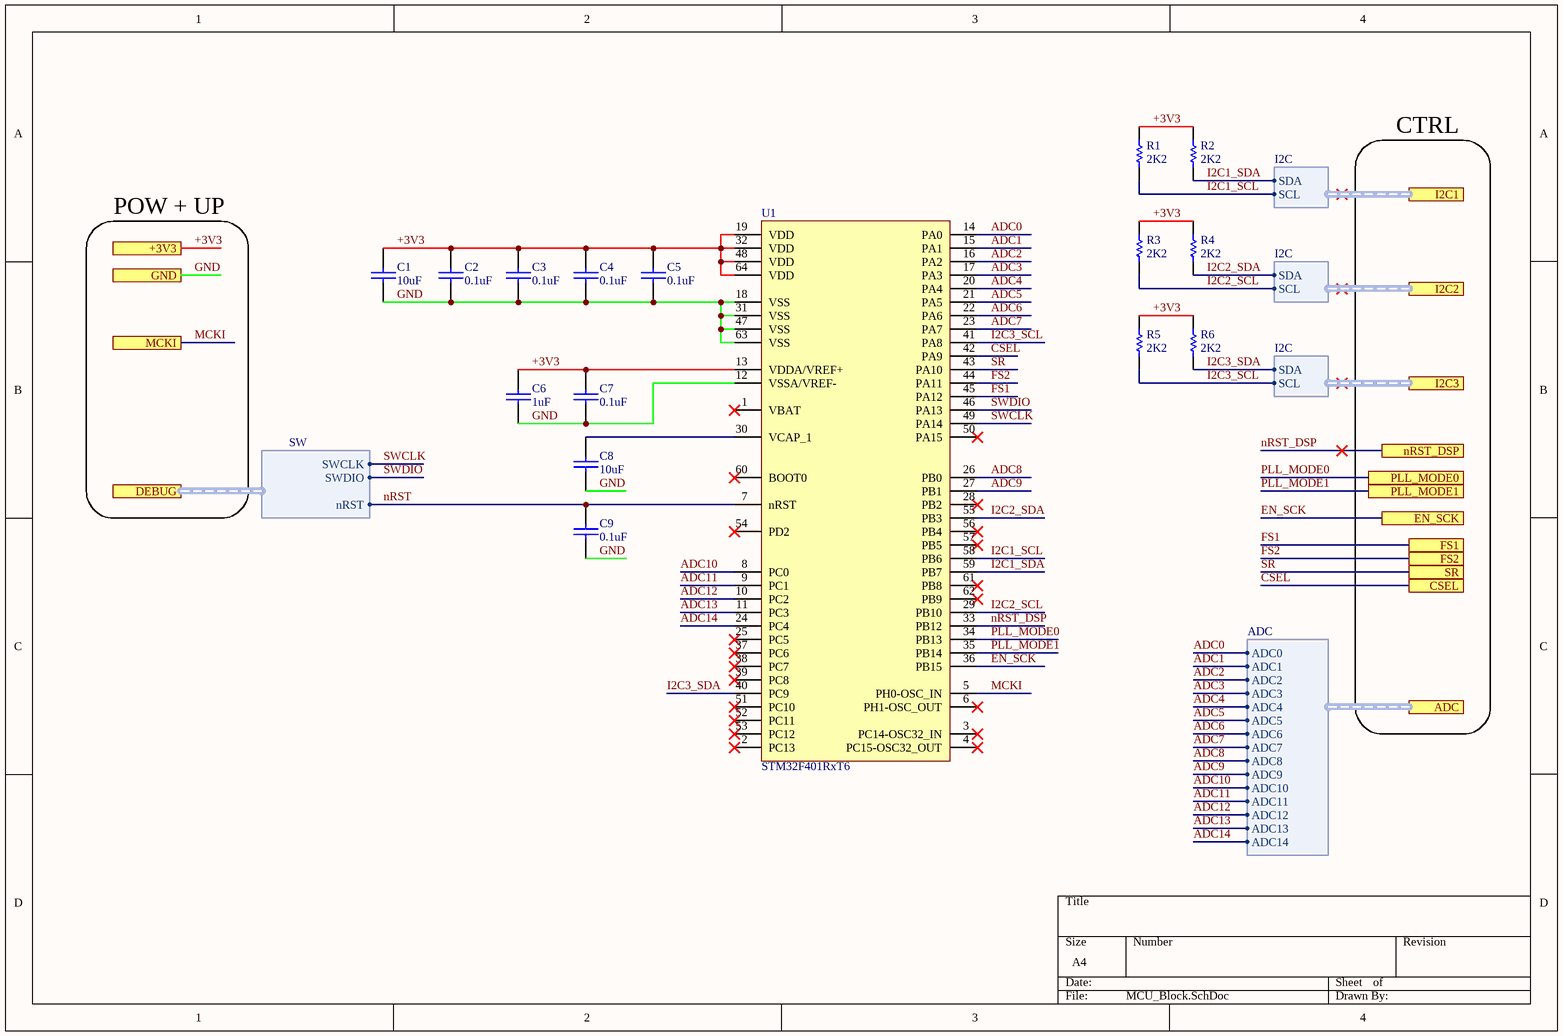
[diagram p5: MCU_Block.SchDoc]

### Parts
(Parts that share a designator on the sheet are numbered #1, #2 ... from top to bottom, then left to right.)
C1#4  10uF  [0603-CAP-TDK]
C2#4  0.1uF  [0402-CAP-TDK]
C3#4  0.1uF  [0402-CAP-TDK]
C4#4  0.1uF  [0402-CAP-TDK]
C5#4  0.1uF  [0402-CAP-TDK]
C6#4  1uF  [0603-CAP-TDK]
C7#3  0.1uF  [0402-CAP-TDK]
C8#2  10uF  [0603-CAP-TDK]
C9#2  0.1uF  [0402-CAP-TDK]
R1#2  2K2  [0402-RES-PANASONIC]
R2#2  2K2  [0402-RES-PANASONIC]
R3#2  2K2  [0402-RES-PANASONIC]
R4#2  2K2  [0402-RES-PANASONIC]
R5#2  2K2  [0402-RES-PANASONIC]
R6#2  2K2  [0402-RES-PANASONIC]
U1#4  STM32F401RxT6  [LQFP-64]

### Ports
+3V3 (see AudioDSP-v2.0_top[4A], ADC_Block[1A], ADC_Interface[1B], CTRL_Connectors[1A], DAC_Block[1B], DSP_Block[1A], PLL_Block[1A], POW_Block[4B]), ADC (harness ADC, see AudioDSP-v2.0_top[5A], CTRL_Connectors[1B]), CSEL (see AudioDSP-v2.0_top[5B], PLL_Block[1B]), DEBUG (harness SW, see AudioDSP-v2.0_top[5A], CTRL_Connectors[1B]), EN_SCK (see AudioDSP-v2.0_top[5B], PLL_Block[1B]), FS1 (see AudioDSP-v2.0_top[5B], PLL_Block[1B]), FS2 (see AudioDSP-v2.0_top[5B], PLL_Block[1B]), GND (see AudioDSP-v2.0_top[4A], ADC_Block[1B], ADC_Interface[1B], CTRL_Connectors[1A], DAC_Block[1B], DSP_Block[1B], IN_Connectors[3A], LPF_Block[1B], LPF_Interface[1B], OUT_Connectors[3B], PLL_Block[1A], POW_Block[1B]), I2C1 (harness I2C, see AudioDSP-v2.0_top[5A]), I2C2 (harness I2C, see AudioDSP-v2.0_top[5B], ADC_Interface[1B]), I2C3 (harness I2C, see AudioDSP-v2.0_top[5B]), MCKI (see AudioDSP-v2.0_top[4B]), nRST_DSP (see AudioDSP-v2.0_top[5B]), PLL_MODE0 (see AudioDSP-v2.0_top[5B], DSP_Block[1C]), PLL_MODE1 (see AudioDSP-v2.0_top[5B], DSP_Block[1C]), SR (see AudioDSP-v2.0_top[5B], PLL_Block[1B])

### Harnesses
SW: SWCLK, SWDIO, nRST
ADC: ADC0, ADC1, ADC2, ADC3, ADC4, ADC5, ADC6, ADC7, ADC8, ADC9, ADC10, ADC11, ADC12, ADC13, ADC14
I2C: SCL, SDA

### Nets
+3V3: C1#4.2 C2#4.2 C3#4.2 C4#4.2 C5#4.2 C6#4.2 C7#3.2 R1#2.2 R2#2.2 R3#2.2 R4#2.2 R5#2.2 R6#2.2 U1#4.13(VDDA/VREF+) U1#4.19(VDD) U1#4.32(VDD) U1#4.48(VDD) U1#4.64(VDD) ; port +3V3
ADC0: U1#4.14(PA0) ; port ADC.ADC0
ADC1: U1#4.15(PA1) ; port ADC.ADC1
ADC2: U1#4.16(PA2) ; port ADC.ADC2
ADC3: U1#4.17(PA3) ; port ADC.ADC3
ADC4: U1#4.20(PA4) ; port ADC.ADC4
ADC5: U1#4.21(PA5) ; port ADC.ADC5
ADC6: U1#4.22(PA6) ; port ADC.ADC6
ADC7: U1#4.23(PA7) ; port ADC.ADC7
ADC8: U1#4.26(PB0) ; port ADC.ADC8
ADC9: U1#4.27(PB1) ; port ADC.ADC9
ADC10: U1#4.8(PC0) ; port ADC.ADC10
ADC11: U1#4.9(PC1) ; port ADC.ADC11
ADC12: U1#4.10(PC2) ; port ADC.ADC12
ADC13: U1#4.11(PC3) ; port ADC.ADC13
ADC14: U1#4.24(PC4) ; port ADC.ADC14
CSEL: U1#4.42(PA9) ; port CSEL
EN_SCK: U1#4.36(PB15) ; port EN_SCK
FS1: U1#4.45(PA12) ; port FS1
FS2: U1#4.44(PA11) ; port FS2
GND: C1#4.1 C2#4.1 C3#4.1 C4#4.1 C5#4.1 C6#4.1 C7#3.1 C8#2.1 C9#2.1 U1#4.12(VSSA/VREF-) U1#4.18(VSS) U1#4.31(VSS) U1#4.47(VSS) U1#4.63(VSS) ; port GND
I2C1_SCL: R1#2.1 U1#4.58(PB6) ; port I2C1.SCL  [project net I2C1.SCL]
I2C1_SDA: R2#2.1 U1#4.59(PB7) ; port I2C1.SDA  [project net I2C1.SDA]
I2C2_SCL: R3#2.1 U1#4.29(PB10) ; port I2C2.SCL  [project net I2C2.SCL]
I2C2_SDA: R4#2.1 U1#4.55(PB3) ; port I2C2.SDA  [project net I2C2.SDA]
I2C3_SCL: R5#2.1 U1#4.41(PA8) ; port I2C3.SCL  [project net I2C3.SCL]
I2C3_SDA: R6#2.1 U1#4.40(PC9) ; port I2C3.SDA  [project net I2C3.SDA]
MCKI: U1#4.5(PH0-OSC_IN) ; port MCKI  [project net MCK]
nRST: C9#2.2 U1#4.7(nRST) ; port DEBUG.nRST
nRST_DSP: U1#4.33(PB12) ; port nRST_DSP
PLL_MODE0: U1#4.34(PB13) ; port PLL_MODE0
PLL_MODE1: U1#4.35(PB14) ; port PLL_MODE1
SR: U1#4.43(PA10) ; port SR
SWCLK: U1#4.49(PA14) ; port DEBUG.SWCLK
SWDIO: U1#4.46(PA13) ; port DEBUG.SWDIO
NetC8#2_2: C8#2.2 U1#4.30(VCAP_1)

Not connected (* = marked no-connect by the designer): U1#4 1(VBAT)* 2(PC13)* 3(PC14-OSC32_IN)* 4(PC15-OSC32_OUT)* 6(PH1-OSC_OUT)* 25(PC5)* 28(PB2)* 37(PC6)* 38(PC7)* 39(PC8)* 50(PA15)* 51(PC10)* 52(PC11)* 53(PC12)* 54(PD2)* 56(PB4)* 57(PB5)* 60(BOOT0)* 61(PB8)* 62(PB9)*

### Notes on the sheet
- CTRL
- POW + UP

### Library data of the parts
C1#4 C2#4 C3#4 C4#4 C5#4 C6#4 C7#3 C8#2 C9#2 = CAP-SMD
  C1#4 C8#2: JLCPart: C96446
  C2#4 C3#4 C4#4 C5#4 C7#3 C9#2: JLCPart: C307331
  C6#4: JLCPart: C15849
R1#2 R2#2 R3#2 R4#2 R5#2 R6#2 = RES-SMD: JLCPart: C25879
U1#4 = STM32F401RxT6: JLCPart: C74524

## Sheet CTRL_Connectors.SchDoc
size A4; SheetNumber: 9; SheetTotal: 13
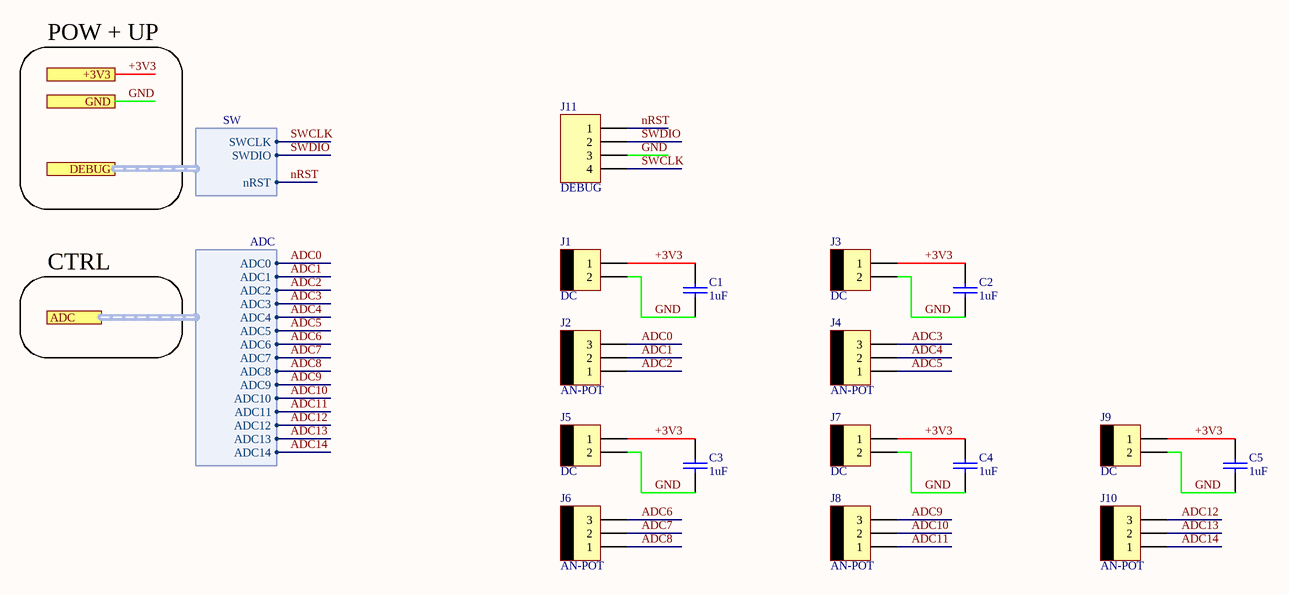
[diagram p6: CTRL_Connectors.SchDoc]

### Parts
(Parts that share a designator on the sheet are numbered #1, #2 ... from top to bottom, then left to right.)
C1#5  1uF  [0603-CAP-TDK]
C2#5  1uF  [0603-CAP-TDK]
C3#5  1uF  [0603-CAP-TDK]
C4#5  1uF  [0603-CAP-TDK]
C5#5  1uF  [0603-CAP-TDK]
J1  DC  [MOLEX-2]
J2  AN-POT  [MOLEX-3]
J3  DC  [MOLEX-2]
J4  AN-POT  [MOLEX-3]
J5  DC  [MOLEX-2]
J6  AN-POT  [MOLEX-3]
J7  DC  [MOLEX-2]
J8  AN-POT  [MOLEX-3]
J9  DC  [MOLEX-2]
J10  AN-POT  [MOLEX-3]
J11  DEBUG  [SIP1X4]

### Ports
+3V3 (see AudioDSP-v2.0_top[6A], ADC_Block[1A], ADC_Interface[1B], DAC_Block[1B], DSP_Block[1A], MCU_Block[1A], PLL_Block[1A], POW_Block[4B]), ADC (harness ADC, see AudioDSP-v2.0_top[6A], MCU_Block[4C]), DEBUG (harness SW, see AudioDSP-v2.0_top[6A], MCU_Block[1B]), GND (see AudioDSP-v2.0_top[6A], ADC_Block[1B], ADC_Interface[1B], DAC_Block[1B], DSP_Block[1B], IN_Connectors[3A], LPF_Block[1B], LPF_Interface[1B], MCU_Block[1B], OUT_Connectors[3B], PLL_Block[1A], POW_Block[1B])

### Harnesses
SW: SWCLK, SWDIO, nRST
ADC: ADC0, ADC1, ADC2, ADC3, ADC4, ADC5, ADC6, ADC7, ADC8, ADC9, ADC10, ADC11, ADC12, ADC13, ADC14

### Nets
+3V3: C1#5.2 C2#5.2 C3#5.2 C4#5.2 C5#5.2 J1.1 J3.1 J5.1 J7.1 J9.1 ; port +3V3
ADC0: J2.3 ; port ADC.ADC0
ADC1: J2.2 ; port ADC.ADC1
ADC2: J2.1 ; port ADC.ADC2
ADC3: J4.3 ; port ADC.ADC3
ADC4: J4.2 ; port ADC.ADC4
ADC5: J4.1 ; port ADC.ADC5
ADC6: J6.3 ; port ADC.ADC6
ADC7: J6.2 ; port ADC.ADC7
ADC8: J6.1 ; port ADC.ADC8
ADC9: J8.3 ; port ADC.ADC9
ADC10: J8.2 ; port ADC.ADC10
ADC11: J8.1 ; port ADC.ADC11
ADC12: J10.3 ; port ADC.ADC12
ADC13: J10.2 ; port ADC.ADC13
ADC14: J10.1 ; port ADC.ADC14
GND: C1#5.1 C2#5.1 C3#5.1 C4#5.1 C5#5.1 J1.2 J3.2 J5.2 J7.2 J9.2 J11.3 ; port GND
nRST: J11.1 ; port DEBUG.nRST
SWCLK: J11.4 ; port DEBUG.SWCLK
SWDIO: J11.2 ; port DEBUG.SWDIO

### Notes on the sheet
- POW + UP
- CTRL

### Library data of the parts
C1#5 C2#5 C3#5 C4#5 C5#5 = CAP-SMD: JLCPart: C15849
J1 J3 J5 J7 J9 = MOLEX-2
J2 J4 J6 J8 J10 = MOLEX-3
J11 = CON1X4

## Sheet ADC_Block.SchDoc
size A4; SheetNumber: 11; SheetTotal: 13
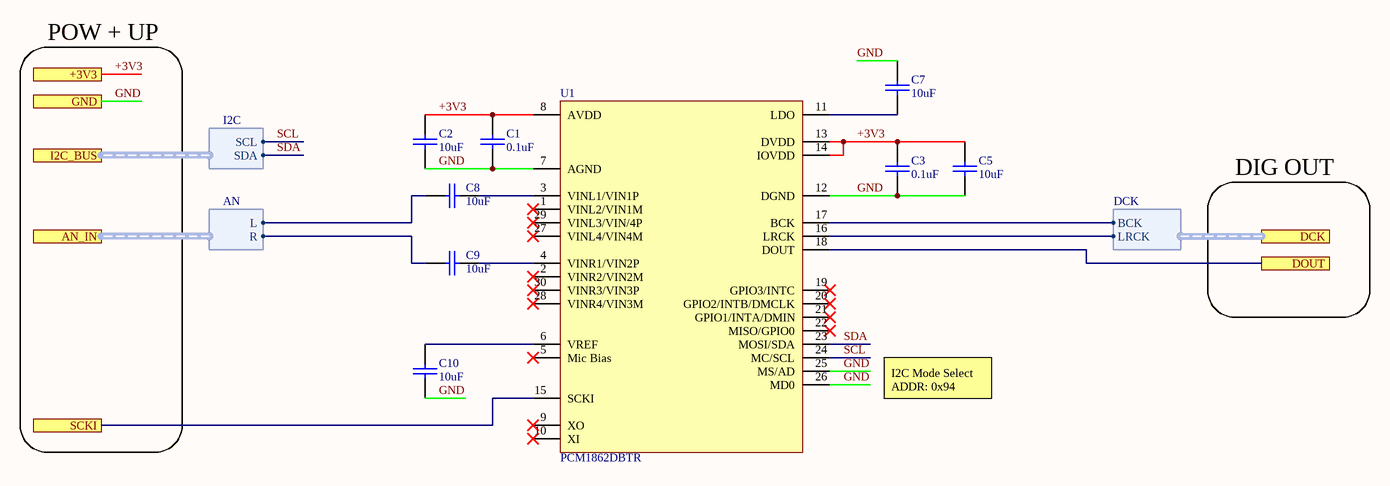
[diagram p7: ADC_Block.SchDoc]

### Parts
(Parts that share a designator on the sheet are numbered #1, #2 ... from top to bottom, then left to right.)
C1#6  0.1uF  [0402-CAP-TDK]
C2#6  10uF  [0603-CAP-TDK]
C3#6  0.1uF  [0402-CAP-TDK]
C5#6  10uF  [0603-CAP-TDK]
C7#4  10uF  [0603-CAP-TDK]
C8#3  10uF  [0603-CAP-TDK]
C9#3  10uF  [0603-CAP-TDK]
C10#2  10uF  [0603-CAP-TDK]
U1#5  PCM1862DBTR  [TI-TSSOP-30-DBT0030A]

### Ports
+3V3 (see ADC_Interface[2B], ADC_Interface[1B], CTRL_Connectors[1A], DAC_Block[1B], DSP_Block[1A], MCU_Block[1A], PLL_Block[1A], POW_Block[4B]), AN_IN (harness AN, see ADC_Interface[2B]), DCK (harness DCK, see ADC_Interface[3B], ADC_Interface[4B]), DOUT (see ADC_Interface[3B]), GND (see ADC_Interface[2B], ADC_Interface[1B], CTRL_Connectors[1A], DAC_Block[1B], DSP_Block[1B], IN_Connectors[3A], LPF_Block[1B], LPF_Interface[1B], MCU_Block[1B], OUT_Connectors[3B], PLL_Block[1A], POW_Block[1B]), I2C_BUS (harness I2C, see ADC_Interface[2B], DSP_Block[1B]), SCKI (see ADC_Interface[2B])

### Harnesses
I2C: SCL, SDA
AN: L, R
DCK: BCK, LRCK

### Nets
+3V3: C1#6.2 C2#6.2 C3#6.2 C5#6.2 U1#5.8(AVDD) U1#5.13(DVDD) U1#5.14(IOVDD) ; port +3V3
GND: C1#6.1 C2#6.1 C3#6.1 C5#6.1 C7#4.2 C10#2.1 U1#5.7(AGND) U1#5.12(DGND) U1#5.25(MS/AD) U1#5.26(MD0) ; port GND
SCL: U1#5.24(MC/SCL) ; port I2C_BUS.SCL
SDA: U1#5.23(MOSI/SDA) ; port I2C_BUS.SDA
NetC7#4_1: C7#4.1 U1#5.11(LDO)
NetC8#3_1: C8#3.1 U1#5.3(VINL1/VIN1P)
NetC8#3_2: C8#3.2 ; port AN_IN.L
NetC9#3_1: C9#3.1 U1#5.4(VINR1/VIN2P)
NetC9#3_2: C9#3.2 ; port AN_IN.R
NetC10#2_2: C10#2.2 U1#5.6(VREF)
NetU1#5_15: U1#5.15(SCKI) ; port SCKI
NetU1#5_16: U1#5.16(LRCK) ; port DCK.LRCK
NetU1#5_17: U1#5.17(BCK) ; port DCK.BCK
NetU1#5_18: U1#5.18(DOUT) ; port DOUT

Not connected (* = marked no-connect by the designer): U1#5 1(VINL2/VIN1M)* 2(VINR2/VIN2M)* 5(Mic_Bias)* 9(XO)* 10(XI)* 19(GPIO3/INTC)* 20(GPIO2/INTB/DMCLK)* 21(GPIO1/INTA/DMIN)* 22(MISO/GPIO0)* 27(VINL4/VIN4M)* 28(VINR4/VIN3M)* 29(VINL3/VIN/4P)* 30(VINR3/VIN3P)*

### Notes on the sheet
- POW + UP
- DIG OUT
- I2C Mode Select
  ADDR: 0x94

### Library data of the parts
C1#6 C2#6 C3#6 C5#6 C7#4 C8#3 C9#3 C10#2 = CAP-SMD

## Sheet LPF_Block.SchDoc
size A4; SheetNumber: 13; SheetTotal: 13
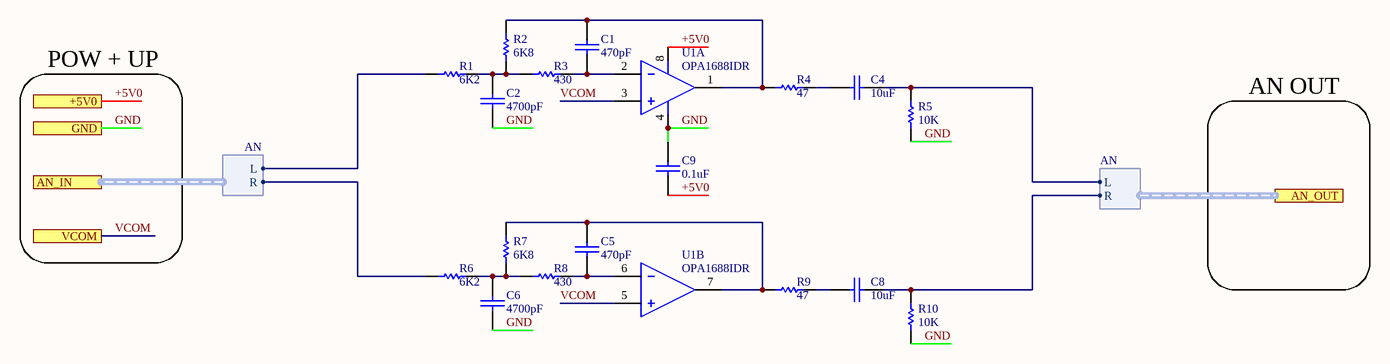
[diagram p8: LPF_Block.SchDoc]

### Parts
(Parts that share a designator on the sheet are numbered #1, #2 ... from top to bottom, then left to right.)
C1#7  470pF  [0402-CAP-TDK]
C2#7  4700pF  [0402-CAP-TDK]
C4#6  10uF  [0603-CAP-TDK]
C5#7  470pF  [0402-CAP-TDK]
C6#5  4700pF  [0402-CAP-TDK]
C8#4  10uF  [0603-CAP-TDK]
C9#4  0.1uF  [0402-CAP-TDK]
R1#3  6K2  [0603-RES-PANASONIC]
R2#3  6K8  [0402-RES-PANASONIC]
R3#3  430  [0402-RES-PANASONIC]
R4#3  47  [0402-RES-PANASONIC]
R5#3  10K  [0402-RES-PANASONIC]
R6#3  6K2  [0603-RES-PANASONIC]
R7  6K8  [0402-RES-PANASONIC]
R8  430  [0402-RES-PANASONIC]
R9  47  [0402-RES-PANASONIC]
R10  10K  [0402-RES-PANASONIC]
U1#6  OPA1688IDR  [TI-SOIC-8]  (parts A,B of 2)

### Ports
+5V0 (see LPF_Interface[2B], DAC_Block[1B], LPF_Interface[1B], POW_Block[4B]), AN_IN (harness AN, see LPF_Interface[2B]), AN_OUT (harness AN, see LPF_Interface[3B]), GND (see LPF_Interface[2B], ADC_Block[1B], ADC_Interface[1B], CTRL_Connectors[1A], DAC_Block[1B], DSP_Block[1B], IN_Connectors[3A], LPF_Interface[1B], MCU_Block[1B], OUT_Connectors[3B], PLL_Block[1A], POW_Block[1B]), VCOM (see LPF_Interface[2B], DAC_Block[4C], LPF_Interface[1B])

### Harnesses
AN: L, R

### Nets
+5V0: C9#4.1 U1#6.8(VDD) ; port +5V0
GND: C2#7.1 C6#5.1 C9#4.2 R5#3.1 R10.1 U1#6.4(GND) ; port GND
VCOM: U1#6.3(1IN+) U1#6.5(2IN+) ; port VCOM
NetC1#7_1: C1#7.1 R3#3.1 U1#6.2(1IN-)
NetC1#7_2: C1#7.2 R2#3.2 R4#3.2 U1#6.1(1OUT)
NetC2#7_2: C2#7.2 R1#3.1 R2#3.1 R3#3.2
NetC4#6_1: C4#6.1 R5#3.2 ; port AN_OUT.L
NetC4#6_2: C4#6.2 R4#3.1
NetC5#7_1: C5#7.1 R8.1 U1#6.6(2IN-)
NetC5#7_2: C5#7.2 R7.2 R9.2 U1#6.7(2OUT)
NetC6#5_2: C6#5.2 R6#3.1 R7.1 R8.2
NetC8#4_1: C8#4.1 R10.2 ; port AN_OUT.R
NetC8#4_2: C8#4.2 R9.1
NetR1#3_2: R1#3.2 ; port AN_IN.L
NetR6#3_2: R6#3.2 ; port AN_IN.R

### Notes on the sheet
- POW + UP
- AN OUT

### Library data of the parts
C1#7 C2#7 C4#6 C5#7 C6#5 C8#4 C9#4 = CAP-SMD
R1#3 R2#3 R3#3 R4#3 R5#3 R6#3 R7-R10 = RES-SMD
U1#6 = OPA1688IDR: as U2#2 on sheet DAC_Block

## Nets that join several sheets
+3V3: PLL_Block (20 pins), DSP1 (14 pins), DSP2 (15 pins), DAC_Block (C1#2.2 C2#2.2 U1#2.9), POW_Block (6 pins), MCU_Block (18 pins), CTRL_Connectors (10 pins)
+5V0: DAC_Block (7 pins), POW_Block (9 pins)
ADC0: MCU_Block (U1#4.14), CTRL_Connectors (J2.3)
ADC1: MCU_Block (U1#4.15), CTRL_Connectors (J2.2)
ADC2: MCU_Block (U1#4.16), CTRL_Connectors (J2.1)
ADC3: MCU_Block (U1#4.17), CTRL_Connectors (J4.3)
ADC4: MCU_Block (U1#4.20), CTRL_Connectors (J4.2)
ADC5: MCU_Block (U1#4.21), CTRL_Connectors (J4.1)
ADC6: MCU_Block (U1#4.22), CTRL_Connectors (J6.3)
ADC7: MCU_Block (U1#4.23), CTRL_Connectors (J6.2)
ADC8: MCU_Block (U1#4.26), CTRL_Connectors (J6.1)
ADC9: MCU_Block (U1#4.27), CTRL_Connectors (J8.3)
ADC10: MCU_Block (U1#4.8), CTRL_Connectors (J8.2)
ADC11: MCU_Block (U1#4.9), CTRL_Connectors (J8.1)
ADC12: MCU_Block (U1#4.10), CTRL_Connectors (J10.3)
ADC13: MCU_Block (U1#4.11), CTRL_Connectors (J10.2)
ADC14: MCU_Block (U1#4.24), CTRL_Connectors (J10.1)
CSEL: PLL_Block (U1#1.12), MCU_Block (U1#4.42)
EN_SCK: PLL_Block (U3.2), MCU_Block (U1#4.36)
FS1: PLL_Block (U1#1.5), MCU_Block (U1#4.45)
FS2: PLL_Block (U1#1.6), MCU_Block (U1#4.44)
GND: PLL_Block (20 pins), DSP1 (27 pins), DSP2 (26 pins), DAC_Block (15 pins), POW_Block (12 pins), MCU_Block (14 pins), CTRL_Connectors (11 pins)
I2C1.SCL: DSP1 (U1_DSP1.23), DSP2 (U1_DSP2.23), MCU_Block (R1#2.1 U1#4.58)
I2C1.SDA: DSP1 (U1_DSP1.22), DSP2 (U1_DSP2.22), MCU_Block (R2#2.1 U1#4.59)
I2C3.SCL: DAC_Block (U1#2.3), MCU_Block (R5#2.1 U1#4.41)
I2C3.SDA: DAC_Block (U1#2.4), MCU_Block (R6#2.1 U1#4.40)
MCK: PLL_Block (TP1#1.1 U1#1.14), MCU_Block (U1#4.5)
NetU1#2_6: DSP2 (U1_DSP2.15), DAC_Block (U1#2.6)
NetU1#2_7: DSP2 (U1_DSP2.19), DAC_Block (U1#2.7)
NetU1#2_8: DSP2 (U1_DSP2.16), DAC_Block (U1#2.8)
NetU1#2_11: DSP2 (U1_DSP2.14), DAC_Block (U1#2.11)
NetU1#2_12: DSP2 (U1_DSP2.27), DAC_Block (U1#2.12)
NetU1_DSP1_8: DSP1 (U1_DSP1.8 U1_DSP1.16), DSP2 (U1_DSP2.8)
NetU1_DSP1_9: DSP1 (U1_DSP1.9 U1_DSP1.19), DSP2 (U1_DSP2.9)
NetU1_DSP1_14: DSP1 (U1_DSP1.14), DSP2 (U1_DSP2.10)
NetU1_DSP1_15: DSP1 (U1_DSP1.15), DSP2 (U1_DSP2.11)
NetU1_DSP1_27: DSP1 (U1_DSP1.27), DSP2 (U1_DSP2.29)
nRST: MCU_Block (C9#2.2 U1#4.7), CTRL_Connectors (J11.1)
nRST_DSP: DSP1 (U1_DSP1.5), DSP2 (U1_DSP2.5), MCU_Block (U1#4.33)
PLL_MODE0: DSP1 (U1_DSP1.38), DSP2 (U1_DSP2.38), MCU_Block (U1#4.34)
PLL_MODE1: DSP1 (U1_DSP1.39), DSP2 (U1_DSP2.39), MCU_Block (U1#4.35)
SCKO0: PLL_Block (U3.3), DAC_Block (U1#2.5)
SCKO1: PLL_Block (U3.14), DSP2 (U1_DSP2.32)
SCKO4: PLL_Block (U3.6), DSP1 (U1_DSP1.32)
SR: PLL_Block (U1#1.7), MCU_Block (U1#4.43)
SWCLK: MCU_Block (U1#4.49), CTRL_Connectors (J11.4)
SWDIO: MCU_Block (U1#4.46), CTRL_Connectors (J11.2)

## Assembly variants
For Assembly: not fitted J1 J1_CTRL J2 J2_CTRL J3 J3_CTRL J4 J4_CTRL J5 J5_CTRL J6 J6_CTRL J7 J7_CTRL J8 J8_CTRL J9_CTRL J10_CTRL J11_CTRL J12_CTRL J12A_CTRL J12B_CTRL U1_POW U2_POW